# EAGLE design FlukeNic_UNITB (EAGLE 7.7.0)
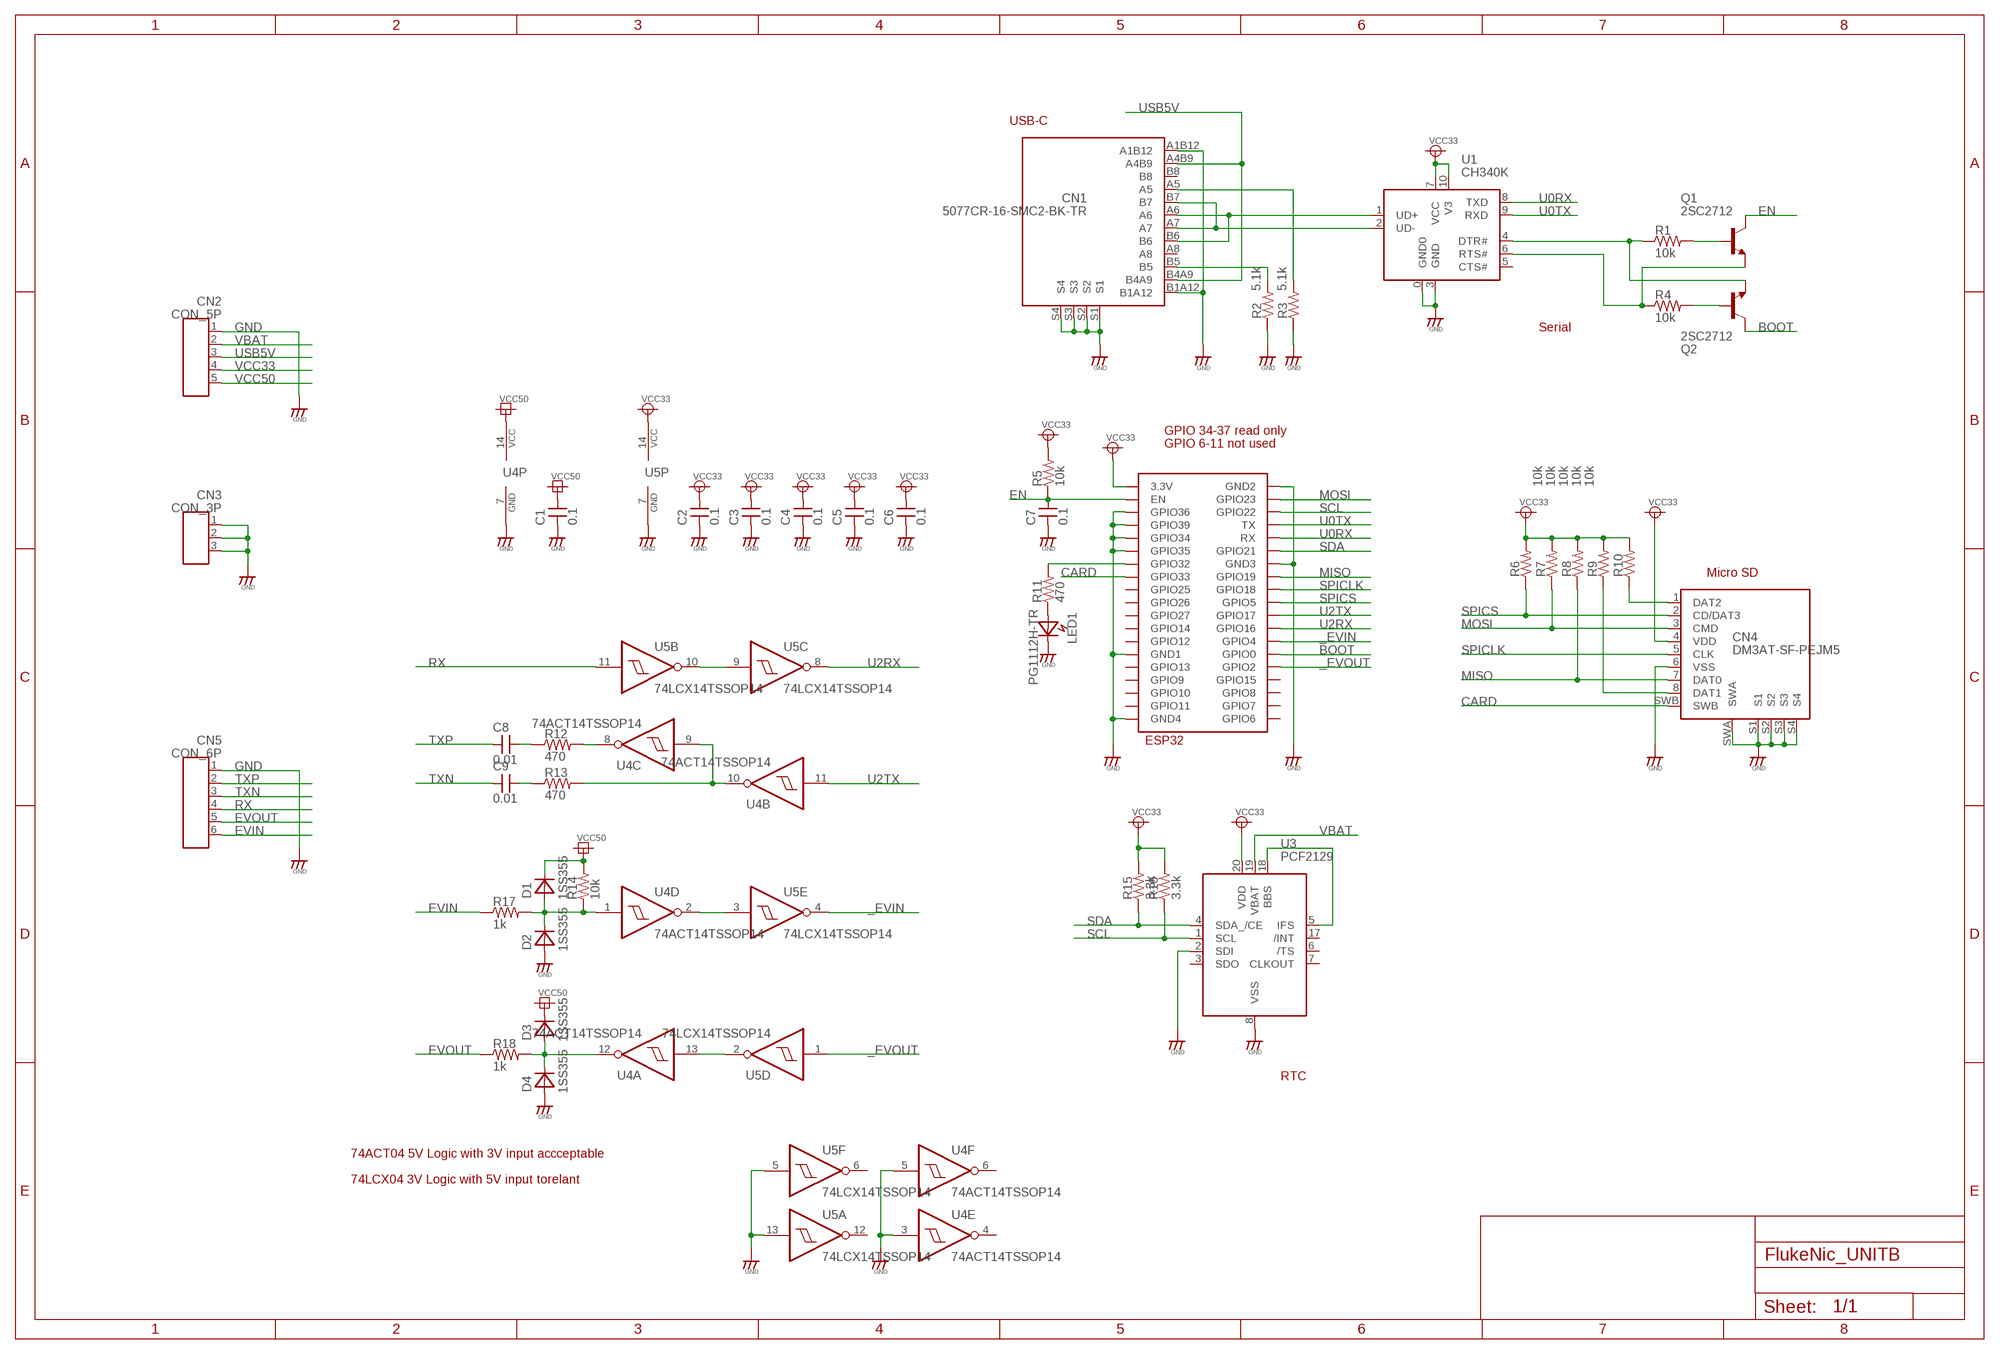
[diagram p0: schematic, sheet 1]

## Parts
C1  0.1  CAPSM2012  [C2012]
C2  0.1  CAPSM2012  [C2012]
C3  0.1  CAPSM2012  [C2012]
C4  0.1  CAPSM2012  [C2012]
C5  0.1  CAPSM2012  [C2012]
C6  0.1  CAPSM2012  [C2012]
C7  0.1  CAPSM2012  [C2012]
C8  0.01  CAPSM2012  [C2012]
C9  0.01  CAPSM2012  [C2012]
CN1  5077CR-16-SMC2-BK-TR  [5077CR-16-SMC2-BK-TR]
CN2  CON_5P  [CON_HDR_SIP5]
CN3  CON_3P  [CON_HDR_SIP3]
CN4  DM3AT-SF-PEJM5  [DM3AT-SF-PEJM5]
CN5  CON_6P  [CON_HDR_SIP6]
D1  1SS355  DIODESOD323  [SOD323]
D2  1SS355  DIODESOD323  [SOD323]
D3  1SS355  DIODESOD323  [SOD323]
D4  1SS355  DIODESOD323  [SOD323]
LED1  PG1112H-TR  LED2125  [LED2125]
Q1  2SC2712  [SC59]
Q2  2SC2712  [SC59]
R1  10k  RSMD2012  [R2012]
R2  5.1k  RSMD2012  [R2012]
R3  5.1k  RSMD2012  [R2012]
R4  10k  RSMD2012  [R2012]
R5  10k  RSMD2012  [R2012]
R6  10k  RSMD2012  [R2012]
R7  10k  RSMD2012  [R2012]
R8  10k  RSMD2012  [R2012]
R9  10k  RSMD2012  [R2012]
R10  10k  RSMD2012  [R2012]
R11  470  RSMD2012  [R2012]
R12  470  RSMD2012  [R2012]
R13  470  RSMD2012  [R2012]
R14  10k  RSMD2012  [R2012]
R15  3.3k  RSMD2012  [R2012]
R16  3.3k  RSMD2012  [R2012]
R17  1k  RSMD2012  [R2012]
R18  1k  RSMD2012  [R2012]
U1  CH340K  [ESSOP10]
U2  ESP32-WROOM  [ESP32-WROOM]
U3  PCF2129  [SO20]
U4  74ACT14TSSOP14  74VHCT14TSSOP14  [TSSOP14]
U5  74LCX14TSSOP14  [TSSOP14]

## Nets
_EVIN: U2.IO4(GPIO4) U5.4(E:O)
_EVOUT: U2.IO2(GPIO2) U5.1(D:I)
BBS: U3.5(IFS) U3.18(BBS)
BOOT: Q2.C U2.IO0(GPIO0)
CARD: CN4.SWB U2.IO33(GPIO33)
DAT1: CN4.8(DAT1) R9.1
DAT2: CN4.1(DAT2) R10.1
EN: C7.2 Q1.C R5.1 U2.EN
EVIN: CN5.6 R17.1
EVOUT: CN5.5 R18.1
GND: C1.1 C2.1 C3.1 C4.1 C5.1 C6.1 C7.1 CN1.A1B12 CN1.B1A12 CN1.S1 CN1.S2 CN1.S3 CN1.S4 CN2.1 CN3.1 CN3.2 CN3.3 CN4.6(VSS) CN4.S1 CN4.S2 CN4.S3 CN4.S4 CN4.SWA CN5.1 D2.1(A) D4.1(A) LED1.K R2.1 R3.1 U1.0(GND0) U1.3(GND) U2.GND1 U2.GND2 U2.GND3 U2.GND4 U2.IO34(GPIO34) U2.IO35(GPIO35) U2.SENSOR_VN(GPIO39) U2.SENSOR_VP(GPIO36) U3.2(SDI) U3.8(VSS) U4.3(E:I) U4.5(F:I) U4.7(P:GND) U5.5(F:I) U5.7(P:GND) U5.13(A:I)
MISO: CN4.7(DAT0) R8.1 U2.IO19(GPIO19)
MOSI: CN4.3(CMD) R7.1 U2.IO23(GPIO23)
N$1: U4.13(A:I) U5.2(D:O)
N$2: U4.2(D:O) U5.3(E:I)
N$4: D1.1(A) D2.2(K) R14.1 R17.2 U4.1(D:I)
N$5: D3.1(A) D4.2(K) R18.2 U4.12(A:O)
N$7: R13.2 U4.9(C:I) U4.10(B:O)
N$8: R12.2 U4.8(C:O)
N$11: U5.9(C:I) U5.10(B:O)
N$16: C8.2 R12.1
N$17: C9.2 R13.1
N$22: LED1.A R11.1
N$31: Q1.B R1.2
N$32: Q2.B R4.2
N$33: CN1.B5 R2.2
N$34: CN1.A5 R3.2
N$35: Q2.E R1.1 U1.4(DTR#)
N$36: Q1.E R4.1 U1.6(RTS#)
RX: CN5.4 U5.11(B:I)
SCL: R16.1 U2.IO22(GPIO22) U3.1(SCL)
SDA: R15.1 U2.IO21(GPIO21) U3.4(SDA_/CE)
SPICLK: CN4.5(CLK) U2.IO18(GPIO18)
SPICS: CN4.2(CD/DAT3) R6.1 U2.IO5(GPIO5)
STATUS: R11.2 U2.IO32(GPIO32)
TXN: C9.1 CN5.3
TXP: C8.1 CN5.2
U0RX: U1.8(TXD) U2.RX
U0TX: U1.9(RXD) U2.TX
U2RX: U2.IO16(GPIO16) U5.8(C:O)
U2TX: U2.IO17(GPIO17) U4.11(B:I)
UD+: CN1.A6 CN1.B6 U1.1(UD+)
UD-: CN1.A7 CN1.B7 U1.2(UD-)
USB5V: CN1.A4B9 CN1.B4A9 CN2.3
VBAT: CN2.2 U3.19(VBAT)
VCC33: C2.2 C3.2 C4.2 C5.2 C6.2 CN2.4 CN4.4(VDD) R5.2 R6.2 R7.2 R8.2 R9.2 R10.2 R15.2 R16.2 U1.7(VCC) U1.10(V3) U2.3V3(3.3V) U3.20(VDD) U5.14(P:VCC)
VCC50: C1.2 CN2.5 D1.2(K) D3.2(K) R14.2 U4.14(P:VCC)
Unconnected: CN1.A8 CN1.B8 U1.5(CTS#) U2.CLK(GPIO6) U2.CMD(GPIO11) U2.IO12(GPIO12) U2.IO13(GPIO13) U2.IO14(GPIO14) U2.IO15(GPIO15) U2.IO25(GPIO25) U2.IO26(GPIO26) U2.IO27(GPIO27) U2.SD0(GPIO7) U2.SD1(GPIO8) U2.SD2(GPIO9) U2.SD3(GPIO10) U3.3(SDO) U3.6(/TS) U3.7(CLKOUT) U3.17(/INT) U4.4(E:O) U4.6(F:O) U5.6(F:O) U5.12(A:O)

## Notes on the sheet
- USB-C
- Serial
- GPIO 34-37 read only
- GPIO 6-11 not used
- Micro SD
- RTC
- 74ACT04 5V Logic with 3V input accceptable
- 74LCX04 3V Logic with 5V input torelant

## Library data of the parts
C1-C9 = FlukeNic:CAP: Non polar capacitor
CN1 = FlukeNic:5077CR-16-SMC2-BK-TR
CN2 = FlukeNic:CON_5P
CN3 = FlukeNic:CON_3P
CN4 = FlukeNic:DM3AT-SF-PEJM5
CN5 = FlukeNic:CON_6P
D1-D4 = FlukeNic:DIODE
LED1 = FlukeNic:LED
Q1 Q2 = FlukeNic:2SC2712
R1-R18 = FlukeNic:R
U1 = FlukeNic:CH340K
U2 = ESP32:ESP32-WROOM
U3 = FlukeNic:PCF2129
U4 U5 = FlukeNic:74*14: Hex schmitt trigger INVERTER

## Board
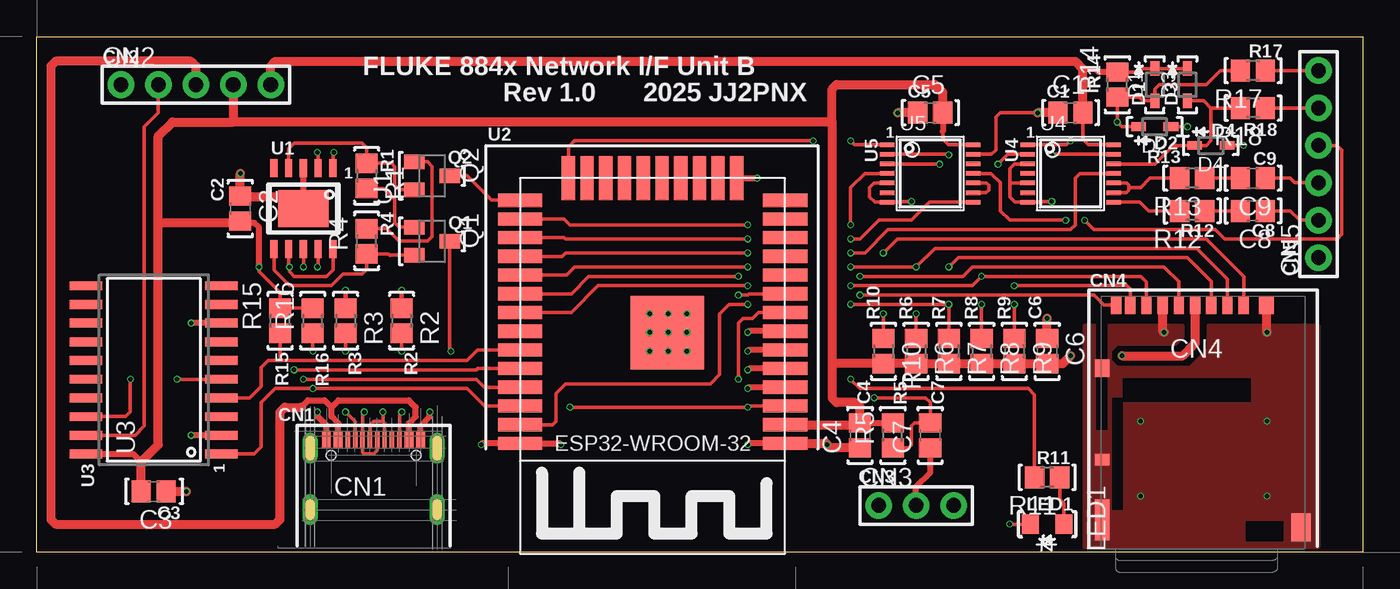
[diagram p1: board, top side]
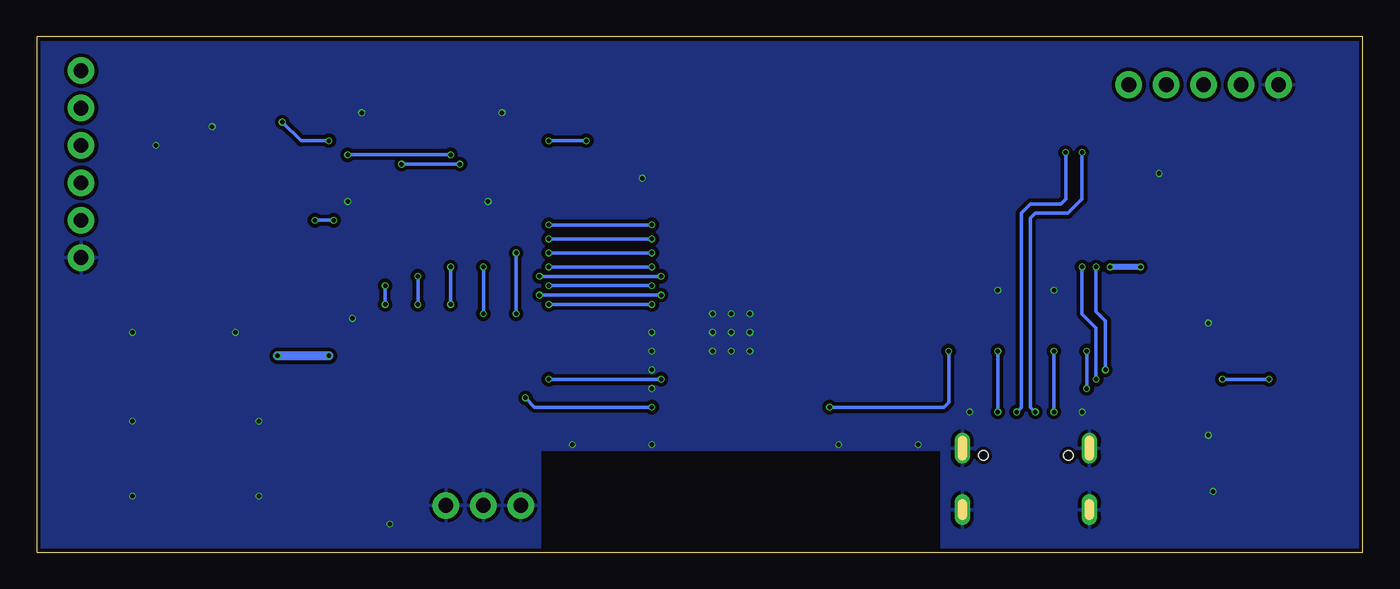
[diagram p2: board, bottom side, seen from below]

Size 90 x 35 mm. Coordinates in mm from the lower left corner, seen from the top.
Outline: 0,0 0,35 90,35 90,0 0,0
Copper layers (1*16): Top 0.035mm / dielectric 1.6mm / Bottom 0.035mm
Design rules "jlcpcb-2layers *": minimum track width 5mil, minimum drill 0.3mm, track to track 5mil, track to pad 5mil, pad to pad 5mil, via to via 5mil, smd to smd 5mil, copper to edge 0.2mm, drill to drill 6mil, minimum pad ring 10mil, minimum via ring 3mil, stop-mask expansion 4mil, vias tented up to drill 0mil, thermal gap 10mil

### Footprints (pad centres in the part's own frame; a part is rotated, then mirrored left to right if it is on the bottom)
C2012 = smd 1.3 x 1.5: 1 -0.85,0; 2 0.85,0
5077CR-16-SMC2-BK-TR = smd 0.6 x 1.1: A1B12 -3.2,0.03; B1A12 3.2,0.03 | smd 0.6 x 1.14: A4B9 -2.4,0.01; B4A9 2.4,0.01 | smd 0.3 x 1.14: A5 -1.25,0.01; A6 -0.25,0.01; A7 0.25,0.01; A8 1.25,0.01; B5 1.75,0.01; B6 0.75,0.01; B7 -0.75,0.01; B8 -1.75,0.01 | drill 0.55 long: S1 4.32,-0.56; S2 4.32,-4.74; S3 -4.32,-4.74; S4 -4.32,-0.56 | hole 0.65: -2.89,-1.06; 2.89,-1.06
CON_HDR_SIP5 = drill 1: 1 -5.08,0; 2 -2.54,0; 3 0,0; 4 2.54,0; 5 5.08,0
CON_HDR_SIP3 = drill 1: 1 -2.54,0; 2 0,0; 3 2.54,0
DM3AT-SF-PEJM5 = smd 0.7 x 1.2: 1 0,0.6; 2 -1.1,0.6; 3 -2.2,0.6; 4 -3.3,0.6; 5 -4.4,0.6; 6 -5.5,0.6; 7 -6.6,0.6; 8 -7.7,0.6; SWB -8.65,0.6 | smd 1 x 1.2: S1 1.55,0.6; S2 -9.6,-3.7 | smd 1 x 2.8: S3 -9.6,-14 | smd 1.3 x 1.9: S4 3.9,-14.5 | smd 1 x 0.8: SWA -9.6,-9.9
CON_HDR_SIP6 = drill 1: 1 -6.35,0; 2 -3.81,0; 3 -1.27,0; 4 1.27,0; 5 3.81,0; 6 6.35,0
SOD323 = smd 1 x 0.6: 1 -1.1,0; 2 1.1,0
LED2125 = smd 1.3 x 1.15: A 0,1.125; K 0,-1.125
SC59 = smd 1 x 1.4: B -0.95,-1.2; C 0,1.2; E 0.95,-1.2
R2012 = smd 1.3 x 1.5: 1 -0.85,0; 2 0.85,0
ESSOP10 = smd 2.5 x 3.4: 0 0,0 | smd 1.2 x 0.5: 1 -2.75,2; 2 -2.75,1; 3 -2.75,0; 4 -2.75,-1; 5 -2.75,-2; 6 2.75,-2; 7 2.75,-1; 8 2.75,0; 9 2.75,1; 10 2.75,2
ESP32-WROOM = smd 3 x 0.9: 3V3 0,16.74; EN 0,15.47; GND1 0,18.01; GND3 18,18.01; IO0 18,1.5; IO4 18,2.77; IO5 18,6.58; IO12 0,1.5; IO14 0,2.77; IO16 18,4.04; IO17 18,5.31; IO18 18,7.85; IO19 18,9.12; IO21 18,11.66; IO22 18,15.47; IO23 18,16.74; IO25 0,6.58; IO26 0,5.31; IO27 0,4.04; IO32 0,9.12; IO33 0,7.85; IO34 0,11.66; IO35 0,10.39; NC 18,10.39; RX 18,12.93; SENSOR_VN 0,12.93; SENSOR_VP 0,14.2; TX 18,14.2 | smd 0.9 x 3: CLK 9.635,0; CMD 8.365,0; GND2 3.285,0; IO2 14.715,0; IO13 4.555,0; IO15 13.445,0; SD0 10.905,0; SD1 12.175,0; SD2 5.825,0; SD3 7.095,0 | smd 5 x 5: GND4 8,10.5
SO20 = smd 0.6 x 2.2: 1 -5.715,-4.6; 2 -4.445,-4.6; 3 -3.175,-4.6; 4 -1.905,-4.6; 5 -0.635,-4.6; 6 0.635,-4.6; 7 1.905,-4.6; 8 3.175,-4.6; 9 4.445,-4.6; 10 5.715,-4.6; 11 5.715,4.6; 12 4.445,4.6; 13 3.175,4.6; 14 1.905,4.6; 15 0.635,4.6; 16 -0.635,4.6; 17 -1.905,4.6; 18 -3.175,4.6; 19 -4.445,4.6; 20 -5.715,4.6
TSSOP14 = smd 0.305 x 0.991: 1 -1.95,-2.918; 2 -1.3,-2.918; 3 -0.65,-2.918; 4 0,-2.918; 5 0.65,-2.918; 6 1.3,-2.918; 7 1.95,-2.918; 8 1.95,2.918; 9 1.3,2.918; 10 0.65,2.918; 11 0,2.918; 12 -0.65,2.918; 13 -1.3,2.918; 14 -1.95,2.918

### Placement (x,y rotation side)
C1  70.17,29.84 0 top
C2  13.81,23.34 270 top
C3  7.94,4.13 180 top
C4  55.88,7.94 90 top
C5  60.64,29.84 0 top
C6  68.58,13.65 270 top
C7  60.64,7.94 90 top
C8  82.55,23.18 180 top
C9  82.55,25.4 180 top
CN1  22.86,7.62 0 top
CN2  10.79,31.75 0 top
CN3  59.69,3.17 0 top
CN4  81.92,16.19 0 top
CN5  87,26.35 90 top
D1  75.88,31.75 90 top
D2  75.88,28.89 180 top
D3  78.11,31.75 90 top
D4  79.69,27.62 180 top
LED1  68.58,1.91 270 top
Q1  26.83,21.11 270 top
Q2  26.83,25.56 270 top
R1  22.38,25.56 270 top
R2  24.77,15.72 270 top
R3  20.95,15.72 270 top
R4  22.38,21.11 90 top
R5  58.1,7.94 90 top
R6  59.69,13.65 270 top
R7  61.91,13.65 270 top
R8  64.14,13.65 270 top
R9  66.36,13.65 270 top
R10  57.47,13.65 270 top
R11  68.58,5.08 180 top
R12  78.42,23.18 180 top
R13  78.42,25.4 180 top
R14  73.34,31.75 90 top
R15  16.51,15.72 90 top
R16  18.73,15.72 90 top
R17  82.55,32.7 180 top
R18  82.55,30.16 180 top
U1  18.1,23.34 270 top
U2  50.8,25.4 180 top
U3  7.94,12.38 90 top
U4  70.17,25.72 270 top
U5  60.64,25.72 270 top

### Tracks (layer width: path | path; a pad name or v marks a point on that pad's centre or on a via)
_EVIN  (via drill 0.3)
  Top 0.254: v48.26,22.23 36.2,22.23 35.79,22.63 U2.IO4 | U5.4 56.2,25.72 55.24,24.77 v55.24,22.23
  Bottom 0.254: v48.26,22.23 v55.24,22.23
_EVOUT  (via drill 0.3)
  Top 0.254: U2.IO2 36.09,27.51 36.51,27.94 v52.7,27.94 | U5.1 55.52,27.67 v55.24,27.94
  Bottom 0.254: v55.24,27.94 v52.7,27.94
BBS  (via drill 0.3)
  Top 0.254: U3.18 6.03,9.21 6.35,9.53 v6.35,11.75 | U3.5 v9.53,11.75
  Bottom 0.254: v6.35,11.75 v9.53,11.75
BOOT
  Top 0.254: Q2.C 29.21,25.56 30.87,23.9 U2.IO0
CARD  (via drill 0.3)
  Top 0.254: v55.88,17.46 71.75,17.46 72.42,16.79 CN4.SWB | U2.IO33 48.35,17.55 48.26,17.46 v47.62,17.46
  Bottom 0.254: v55.88,17.46 v47.62,17.46
DAT1  (via drill 0.3 pad 0.3)
  Top 0.254: CN4.8 74.22,17.86 73.98,18.1 v66.36,18.1 | R9.1 v66.36,16.83
  Bottom 0.254: v66.36,16.83 v66.36,18.1
DAT2  (via drill 0.3 pad 0.3)
  Top 0.254: CN4.1 81.92,18.73 79.38,21.27 58.42,21.27 v57.47,20.32 | R10.1 v57.47,16.19
  Bottom 0.254: v57.47,16.19 v57.47,20.32
EN  (via drill 0.3)
  Top 0.254: Q1.C 28.03,13.72 v28.1,13.65 | U2.EN 48.35,9.93 v48.26,9.84 v36.2,9.84 | R5.1 59.16,7.09 59.37,7.3 59.37,8.57 59.59,8.79 C7.2 60.64,10.16 60.33,10.48 v56.83,10.48
  Bottom 0.254: v36.2,9.84 28.42,9.84 28.1,10.16 v28.1,13.65 | v48.26,9.84 56.2,9.84 v56.83,10.48
EVIN
  Top 0.254: R17.1 CN5.6
EVOUT
  Top 0.254: R18.1 CN5.5
GND  (via drill 0.3)
  Top 0.254: LED1.K v66.04,1.91 | U2.GND4 42.84,14.9 v42.86,14.92 | U5.13 64.8,27.02 65.09,27.3 65.09,29.53 65.41,29.84 v67.94,29.84 | U4.3 66.37,26.37 66.04,26.04 66.04,25.08 | 66.04,25.08 66.04,24.13 66.4,23.77 U4.7 68.22,23.77 68.26,23.81 v68.9,23.81 | U4.5 66.06,25.07 66.04,25.08 | U5.5 56.82,25.07 56.52,24.77 56.52,24.13 56.88,23.77 U5.7 58.69,23.77 58.74,23.81 v59.37,23.81 | D4.1 v81.92,27.62 | D2.1 v78.11,28.89
  Top 0.305: R3.1 v20.95,17.78 | R2.1 v24.77,17.78
  Top 0.406: U2.IO35 48.35,15.01 v48.26,14.92 | U2.SENSOR_VN 48.35,12.47 v48.26,12.38 | U2.GND1 48.35,7.39 v48.26,7.3 | U3.2 v10.48,7.94 | U3.8 v10.48,15.56 | CN1.A1B12 19.66,8.6 19.05,9.21 v19.05,9.53 | v26.67,9.53 26.67,9.21 26.04,8.57 26.04,7.67 CN1.B1A12 | U2.GND2 v48.9,25.4 | U2.IO34 48.35,13.74 v48.26,13.65 | U2.SENSOR_VP 48.35,11.2 v48.26,11.11 | v35.56,7.3 35.47,7.39 U2.GND3 30.25,7.39 v30.16,7.3 | CN3.2 59.69,4.45 60.64,5.4 C7.1 | 13.95,24.13 arc-45 C2.1 13.87,24.13 | U1.3 U1.0 17.3,24.13
  Top 0.61: C2.1 v13.81,25.72 | C3.1 v10.16,4.13 | C6.1 v68.58,15.88 | CN4.6 76.42,15.03 v76.52,14.92 | CN4.S1 83.47,14.96 v83.5,14.92 | U2.GND1 53.57,7.39 v53.66,7.3 53.87,7.09 C4.1 | C5.1 v58.42,29.84 | C1.1 v67.94,29.84 | 17.3,24.13 13.87,24.13
  other vias: 41.59,16.19 42.86,16.19 44.13,16.19 44.13,14.92 41.59,14.92 41.59,13.65 42.86,13.65 44.13,13.65 74.93,8.89 83.5,8.89 74.93,3.81 83.5,3.81
  pour Top (no thermals): 71.12,15.4 77.79,15.4 77.79,14.61 77.31,14.13 73.34,14.13 72.87,13.65 72.87,13.02 73.34,12.54 78.26,12.54 79.53,13.81 79.53,15.4 87,15.4 87,0.32 71.12,0.32
  pour Bottom (isolate 0.254): 0.32,34.61 0.32,0.32 28.57,0.32 28.57,6.99 55.88,6.99 55.88,0.32 89.85,0.32 89.85,34.61
MISO  (via drill 0.3)
  Top 0.254: v48.26,18.1 38.1,18.1 36.28,16.28 U2.IO19 | CN4.7 75.31,18.35 74.93,18.73 v64.14,18.73 63.5,18.1 v55.24,18.1 | R8.1 v64.14,16.83
  Bottom 0.254: v48.26,18.1 v55.24,18.1 | v64.14,16.83 v64.14,18.73
MOSI  (via drill 0.3)
  Top 0.254: R7.1 v61.91,16.83 v55.24,16.83 | v61.91,19.37 62.55,20 78.11,20 79.72,18.39 CN4.3 | v48.26,16.83 46.99,16.83 46.35,16.19 46.35,12.06 45.72,11.43 35.88,11.43 35.24,10.79 35.24,8.89 35.01,8.66 U2.IO23
  Bottom 0.254: v48.26,16.83 v55.24,16.83 | v61.91,16.83 v61.91,19.37
N$1  (via drill 0.3)
  Top 0.254: U5.2 61.88,27.02 v61.91,26.99 | U4.13 68.93,27.02 v68.9,26.99
  Bottom 0.254: v61.91,26.99 v68.9,26.99
N$2  (via drill 0.3)
  Top 0.254: U4.2 65.91,27.02 v65.25,26.35 | U5.3 61.26,26.37 v61.28,26.35
  Bottom 0.254: v61.28,26.35 v65.25,26.35
N$4  (via drill 0.3)
  Top 0.254: R17.2 80.33,32.7 79.38,31.75 76.2,31.75 75.88,31.43 D1.1 75.08,30.65 74.83,30.9 R14.1 v73.34,29.21 73.66,28.89 D2.2 | U4.1 69.89,27.67 v70.17,27.94
  Bottom 0.254: v70.17,27.94 72.07,27.94 v73.34,29.21
N$5
  Top 0.254: D3.1 79.2,30.65 79.69,30.16 | 79.69,30.16 R18.2 | U4.12 75.9,26.37 77.15,27.62 D4.2 79.38,27.62 79.69,27.94 79.69,30.16
N$7
  Top 0.254: U4.9 73.95,24.42 74.14,24.61 74.14,24.77 | U4.10 73.99,25.07 74.14,24.92 74.14,24.77 | R13.2 75.56,25.4 74.93,24.77 74.14,24.77
N$8
  Top 0.254: U4.8 74.89,23.77 75.47,23.18 R12.2
N$11
  Top 0.254: U5.10 64.47,25.07 64.61,24.92 64.61,24.61 64.42,24.42 U5.9
N$16
  Top 0.254: R12.1 C8.2
N$17
  Top 0.254: R13.1 C9.2
N$22
  Top 0.254: R11.1 69.43,3.6 69.7,3.32 LED1.A
N$31
  Top 0.254: R1.2 23.55,24.71 24.29,23.97 24.29,22.38 24.61,22.06 Q1.B
N$32
  Top 0.254: Q2.B 26.51,26.51 26.83,26.19 26.83,21.43 26.51,21.11 24.61,21.11 23.76,21.96 R4.2
N$33  (via drill 0.3)
  Top 0.254: CN1.B5 24.61,9.37 v24.77,9.53 | R2.2 v24.77,13.65
  Bottom 0.254: v24.77,9.53 v24.77,13.65
N$34  (via drill 0.3)
  Top 0.254: CN1.A5 21.61,8.87 v20.95,9.53 | R3.2 v20.95,13.65
  Bottom 0.254: v20.95,13.65 v20.95,9.53
N$35
  Top 0.254: Q2.E 24.6,24.61 24.29,24.92 24.29,26.19 24.07,26.41 R1.1 22.38,27.46 22.07,27.78 17.46,27.78 17.1,27.42 U1.4
N$36
  Top 0.254: U1.6 16.1,19.14 17.14,18.1 20,18.1 20.8,18.89 22.07,18.89 22.38,19.21 R4.1 23.87,20.26 23.97,20.16 Q1.E
RX  (via drill 0.3)
  Top 0.254: CN5.4 88.27,27.62 88.58,27.3 88.58,21.59 88.27,21.27 80.64,21.27 80.01,21.91 71.75,21.91 v71.12,22.54 | v69.85,22.54 66.04,22.54 65.41,23.18 65.41,25.08 64.77,25.72 U5.11
  Bottom 0.254: v71.12,22.54 v69.85,22.54
SCL  (via drill 0.3)
  Top 0.254: R16.1 v18.73,13.65 | U2.IO22 30.39,9.93 29.21,11.11 v18.73,11.11 16.19,11.11 15.24,10.16 15.24,7.14 14.76,6.67 U3.1
  Bottom 0.254: v18.73,13.65 v18.73,11.11
SDA
  Top 0.254: 16.51,13.02 29.21,13.02 29.93,13.74 U2.IO21 | U3.4 14.45,10.48 15.24,11.27 15.24,12.54 15.72,13.02 16.51,13.02 | R15.1 16.51,13.02
SPICLK  (via drill 0.3)
  Top 0.254: v47.62,18.73 37.47,18.73 36.28,17.55 U2.IO18 | CN4.5 77.52,18.37 76.52,19.37 63.5,19.37 62.87,18.73 v55.88,18.73
  Bottom 0.254: v47.62,18.73 v55.88,18.73
SPICS  (via drill 0.3)
  Top 0.254: v55.24,19.37 v59.69,19.37 60.96,20.64 78.74,20.64 80.81,18.56 CN4.2 | v48.26,19.37 36.51,19.37 35.97,18.82 U2.IO5 | R6.1 v59.69,16.19
  Bottom 0.254: v48.26,19.37 v55.24,19.37 | v59.69,16.19 v59.69,19.37
STATUS  (via drill 0.3)
  Top 0.254: R11.2 67.73,10.69 67.31,11.11 55.88,11.11 v55.24,11.75 | v47.62,11.75 47.62,15.56 47.94,15.88 48.58,15.88 48.98,16.28 U2.IO32
  Bottom 0.254: v55.24,11.75 v47.62,11.75
TXN
  Top 0.254: C9.1 85.09,25.4 85.41,25.08 CN5.3
TXP
  Top 0.254: C8.1 85.09,23.18 85.72,22.54 CN5.2
U0RX  (via drill 0.3)
  Top 0.254: v17.46,12.38 29.84,12.38 29.93,12.47 U2.RX | U1.8 v18.1,19.37
  Bottom 0.254: v18.1,19.37 18.1,16.35 17.46,15.72 v17.46,12.38
U0TX  (via drill 0.3)
  Top 0.254: v18.1,11.75 29.84,11.75 30.39,11.2 U2.TX | U1.9 19.1,19.41 v19.05,19.37
  Bottom 0.254: v19.05,19.37 19.05,16.19 18.1,15.24 v18.1,11.75
U2RX  (via drill 0.3)
  Top 0.254: v48.26,21.27 35.88,21.27 35.79,21.36 U2.IO16 | U5.8 60.6,23.77 59.37,22.54 57.15,22.54 55.88,21.27 v55.24,21.27
  Bottom 0.254: v48.26,21.27 v55.24,21.27
U2TX  (via drill 0.3)
  Top 0.254: v48.26,20.32 35.88,20.32 35.65,20.09 U2.IO17 | U4.11 70.8,25.72 70.48,25.4 70.48,22.23 70.17,21.91 57.78,21.91 56.2,20.32 v55.24,20.32
  Bottom 0.254: v48.26,20.32 v55.24,20.32
UD+  (via drill 0.3)
  Top 0.254: CN1.A6 22.61,8.64 22.86,8.89 23.5,8.89 | CN1.B6 23.61,8.78 23.5,8.89 | 23.5,8.89 v23.5,9.53 | U1.1 20.1,27.08 v20.16,27.15
  Bottom 0.254: v23.5,9.53 23.18,9.84 23.18,23.02 22.54,23.65 20.48,23.65 20.16,23.97 v20.16,27.15
UD-  (via drill 0.3)
  Top 0.254: CN1.A7 23.11,6.92 22.86,6.67 22.23,6.67 22.11,6.78 CN1.B7 22.11,9.41 v22.23,9.53 | U1.2 19.1,27.1 v19.05,27.15
  Bottom 0.254: v22.23,9.53 22.54,9.84 22.54,22.7 22.23,23.02 20,23.02 19.05,23.97 v19.05,27.15
USB5V
  Top 0.406: CN1.A4B9 20.46,8.75 20,9.21 20,9.84 | 20,9.84 20.48,10.32 25.24,10.32 25.72,9.84 25.72,9.21 25.26,8.75 CN1.B4A9 | 17.94,9.84 18.41,10.32 19.53,10.32 20,9.84
  Top 0.61: 17.94,9.84 16.83,9.84 16.51,9.53 16.51,2.22 16.19,1.91 1.27,1.91 0.95,2.22 0.95,33.02 1.27,33.34 10.48,33.34 10.79,33.02 CN2.3
VBAT
  Top 0.254: U3.19 6.67,7.94 7.3,8.57 7.3,28.89 8.26,29.84 CN2.2
VCC33  (via drill 0.3)
  Top 0.254: U5.14 61.87,27.67 61.49,28.04 61.49,28.57 | U1.10 20.1,19.14 19.68,18.73 17.46,18.73 17.14,19.05 v17.14,19.37 17.1,19.41 U1.7 | R16.2 R15.2 16.51,17.62 15.08,19.05 v15.08,19.37
  Top 0.406: v15.08,19.37 15.08,22.07 14.76,22.38 13.91,22.38 | 55.78,8.69 C4.2 R5.2 | U3.20 6.55,6.67 7.09,6.13 | C5.2 61.49,28.57
  Top 0.61: 8.26,22.38 8.26,7.3 7.09,6.13 C3.2 | 8.26,22.38 8.26,28.26 9.21,29.21 13.34,29.21 | 53.98,29.21 13.34,29.21 | 53.98,29.21 53.98,12.7 | 53.98,12.7 53.98,10.48 54.29,10.16 55.56,10.16 55.88,9.84 C4.2 55.75,8.66 U2.3V3 | v70.17,13.34 69.64,12.8 C6.2 R9.2 R8.2 R7.2 R6.2 R10.2 54.08,12.8 53.98,12.7 | v73.66,13.34 77.79,13.34 78.61,14.16 CN4.4 | CN2.4 13.34,29.21 | 8.26,22.38 13.56,22.38 arc45 C2.2 13.91,22.38 | 53.98,29.21 53.98,31.43 54.29,31.75 60.96,31.75 61.49,31.22 C5.2
  Bottom 0.406: v15.08,19.37 v17.14,19.37
  Bottom 0.61: v70.17,13.34 v73.66,13.34
VCC50
  Top 0.254: U4.14 71.39,27.67 71.02,28.04 C1.2 | D3.2 D1.2 75.08,32.85 74.83,32.6 R14.2
  Top 0.406: R14.2 72.08,32.6 71.88,32.8 71.02,32.8
  Top 0.61: CN2.5 15.88,33.02 16.19,33.34 70.48,33.34 71.02,32.8 C1.2

### Text on the board
tDocu: 35 | 90 | 19.5 | 38.5 | 150 | 63 | 84.5 | 96.5 | 133.5
_tPlace: CN2 | CN5 | CN3
_tNames: R17 | FLUKE 884x Network I/F Unit B | Rev 1.0 | 2025 JJ2PNX | C5 | C1 | R14 | D1 | D3 | 1 | 1 | U1 | U2 | U5 | U4 | D2 | D4 | R18 | R1 | 1 | Q2 | R13 | C9 | C2 | R4 | Q1 | R12 | C8 | CN4 | R10 | R6 | R7 | R8 | R9 | C6 | R3 | R2 | R15 | R16 | C4 | R5 | C7 | CN1 | R11 | 1 | U3 | C3 | LED1